# EAGLE schematic pe project (EAGLE 9.6.2)
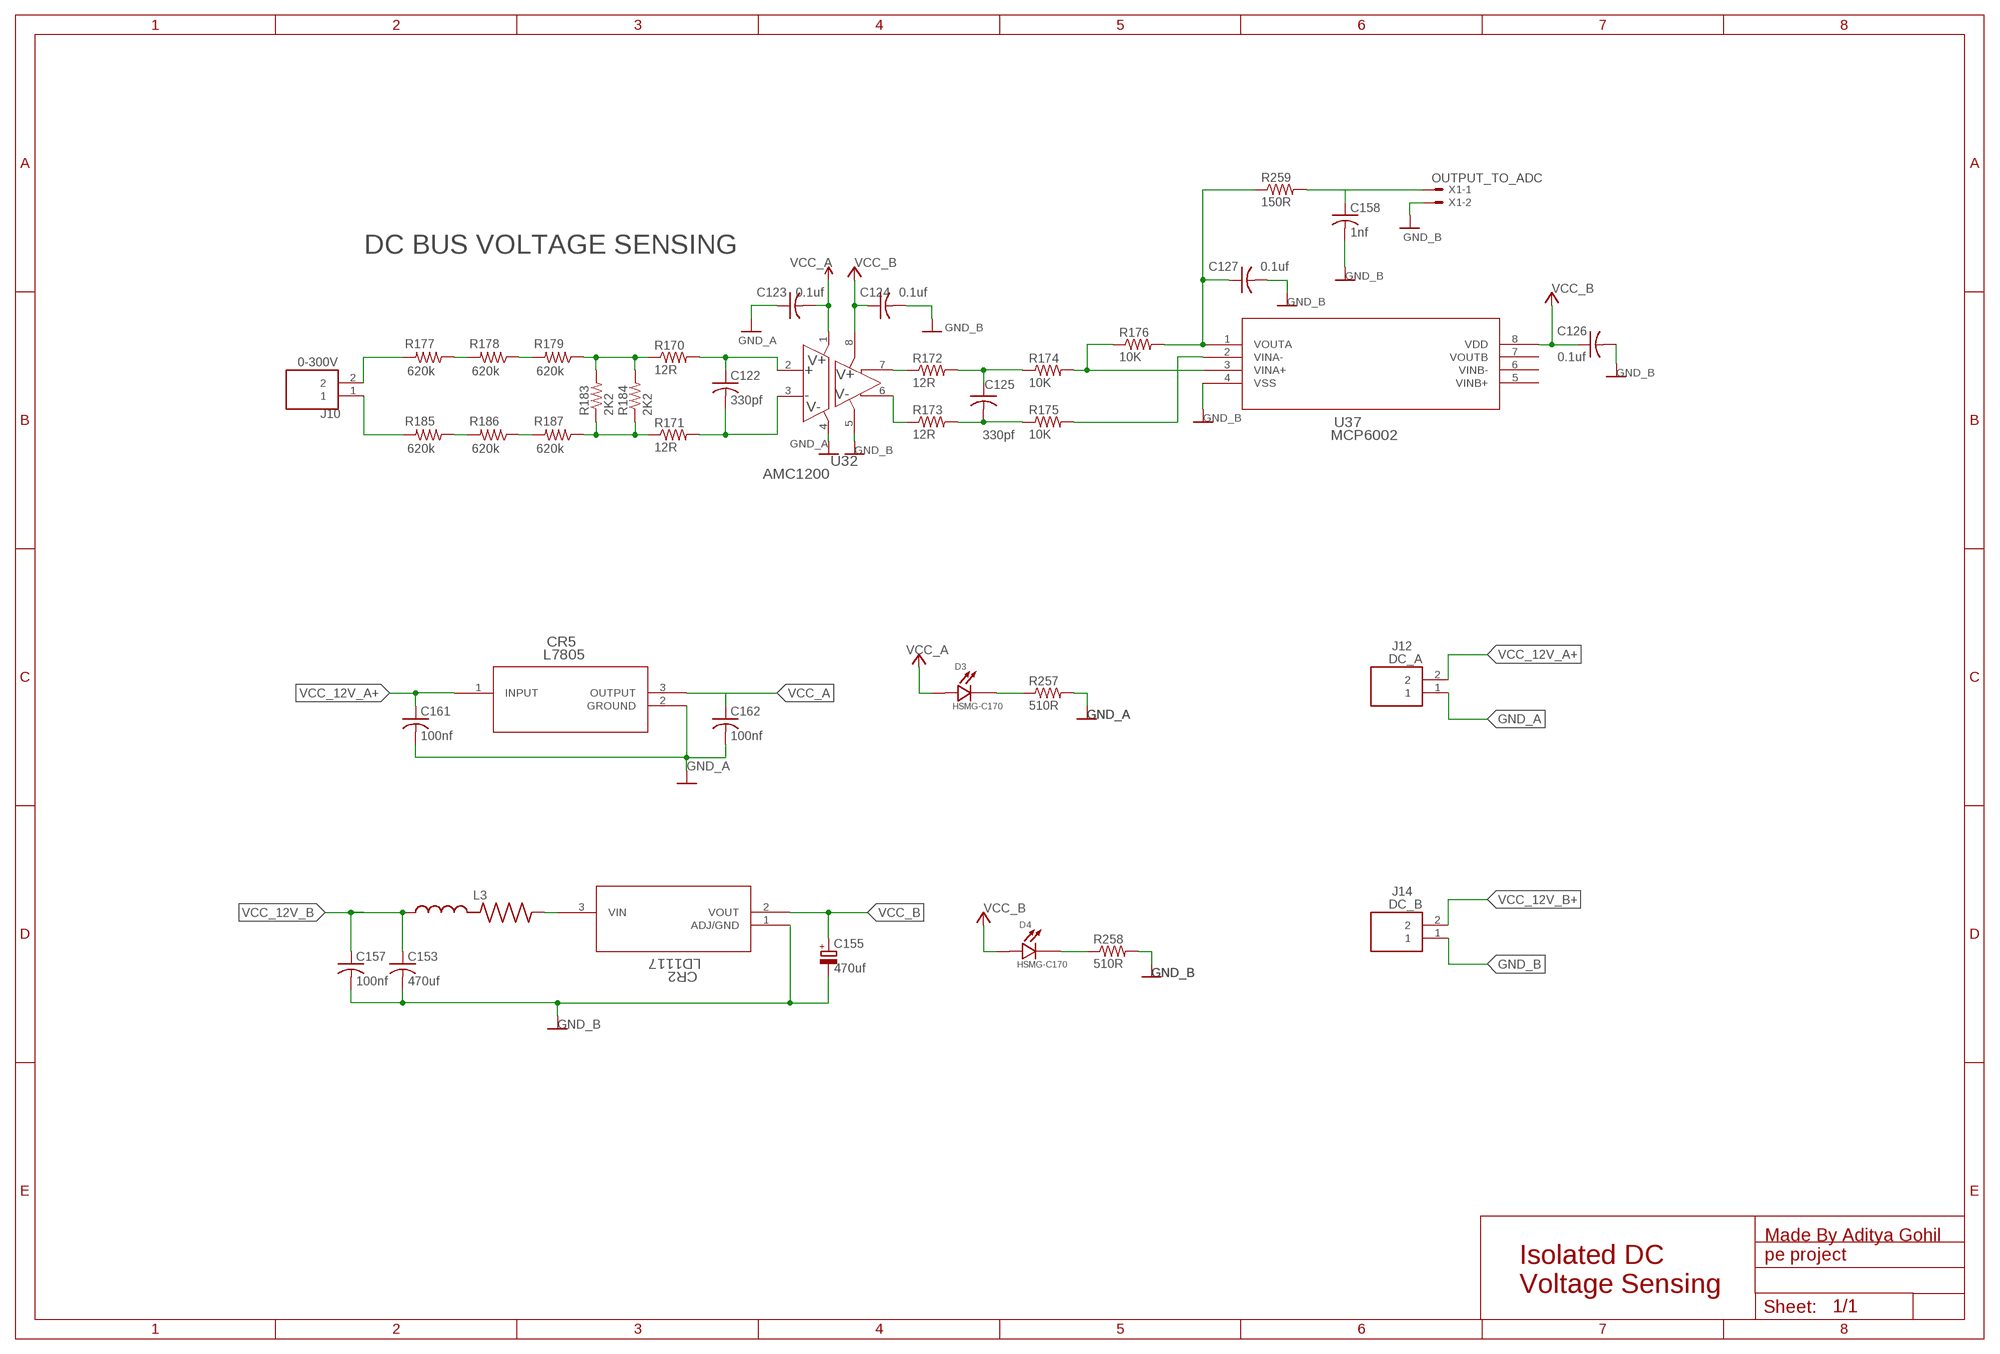
[diagram p0: schematic, sheet 1]

## Parts
C122  330pf  C-USC1206  [C1206]
C123  0.1uf  C-USC1206  [C1206]
C124  0.1uf  C-USC1206  [C1206]
C125  330pf  C-USC1206  [C1206]
C126  0.1uf  C-USC1206  [C1206]
C127  0.1uf  C-USC1206  [C1206]
C153  470uf  C-USC1206  [C1206]
C155  470uf  CPOL-EUE3.5-8  [E3,5-8]
C157  100nf  C-USC1206  [C1206]
C158  1nf  C-USC1206  [C1206]
C161  100nf  C-USC1206  [C1206]
C162  100nf  C-USC1206  [C1206]
CR2  LD1117  LD1117AS33TR  [SOT-223_STM]
CR5  L7805  L7805ACV  [TO-220_STM]
D3  HSMG-C170  [LED_HSMS-C170]
D4  HSMG-C170  [LED_HSMS-C170]
J10  0-300V  4PCV-02-006  [TE_5-1437648-7]
J12  DC_A  4PCV-02-006  [TE_5-1437648-7]
J14  DC_B  4PCV-02-006  [TE_5-1437648-7]
L3  32ohm  BLE32PN300SZ1L  [BEADC3225X220N]
R170  12R  R-US_R1206  [R1206]
R171  12R  R-US_R1206  [R1206]
R172  12R  R-US_R1206  [R1206]
R173  12R  R-US_R1206  [R1206]
R174  10K  R-US_R1206  [R1206]
R175  10K  R-US_R1206  [R1206]
R176  10K  R-US_R1206  [R1206]
R177  620k  R-US_R2512  [R2512]
R178  620k  R-US_R2512  [R2512]
R179  620k  R-US_R2512  [R2512]
R183  2K2  R-US_R1206  [R1206]
R184  2K2  R-US_R1206  [R1206]
R185  620k  R-US_R2512  [R2512]
R186  620k  R-US_R2512  [R2512]
R187  620k  R-US_R2512  [R2512]
R257  510R  R-US_R1206  [R1206]
R258  510R  R-US_R1206  [R1206]
R259  150R  R-US_R1206  [R1206]
U32  AMC1200  AMC1200STDUBRQ1  [DUB0008A_N]
U37  MCP6002  MCP6002T-I/SN  [SOIC8-N_MC_MCH]
X1  OUTPUT_TO_ADC  22-23-2021  [22-23-2021]

## Nets
AC_V_B_OUT: C127.1 R176.2 R259.1 U37.1(VOUTA)
GND_A: C123.1 C161.2 C162.2 CR5.2(GROUND) J12.1 R257.2 U32.4(GND1) ; supply symbol labelled GND
GND_B: C124.2 C126.2 C127.2 C153.2 C155.- C157.2 C158.2 CR2.1(ADJ/GND) J14.1 R258.2 U32.5(GND2) U37.4(VSS) X1.2 ; supply symbol labelled GND
N$1: R170.1 R179.1 R183.2 R184.2
N$2: R171.1 R183.1 R184.1 R187.1
N$43: C122.1 R170.2 U32.2(VINP)
N$46: R172.1 U32.7(VOUTP)
N$47: R173.1 U32.6(VOUTN)
N$48: C125.2 R173.2 R175.1
N$49: C125.1 R172.2 R174.1
N$50: R174.2 R176.1 U37.3(VINA+)
N$62: R177.1 R178.2
N$69: R178.1 R179.2
N$76: R175.2 U37.2(VINA-)
N$79: R185.1 R186.2
N$80: R186.1 R187.2
N$85: J10.2 R177.2
N$87: J10.1 R185.2
N$88: C122.2 R171.2 U32.3(VINN)
N$171: CR2.3(VIN) L3.2
N$176: D3.C R257.1
N$177: D4.C R258.1
OUTPUT_TO_ADC: C158.1 R259.2 X1.1
VCC_12V_A+: C161.1 CR5.1(INPUT) J12.2
VCC_12V_B: C153.1 C157.1 L3.1
VCC_12V_B+: J14.2
VCC_A: C123.2 C162.1 CR5.3(OUTPUT) D3.A U32.1(VDD1) ; supply symbol labelled VCC_2, VCC
VCC_B: C124.1 C126.1 C155.+ CR2.2(VOUT) D4.A U32.8(VDD2) U37.8(VDD) ; supply symbol labelled VCC
Unconnected: U37.5(VINB+) U37.6(VINB-) U37.7(VOUTB)

## Notes on the sheet
- DC BUS VOLTAGE SENSING
- Made By Aditya Gohil
- Isolated DC 
  Voltage Sensing

## Library data of the parts
C122-C127 C153 C157 C158 C161 C162 = rcl:C-US: CAPACITOR, American symbol; SPICEPREFIX: C
C155 = rcl:CPOL-EU: POLARIZED CAPACITOR, European symbol; SPICEPREFIX: C
CR2 = LD1117as:LD1117AS33TR; COPYRIGHT: Copyright (C) 2026 Ultra Librarian. All rights reserved.; DATASHEET: https://www.st.com/resource/en/datasheet/ld1117a.pdf; DESCRIPTION: Low drop fixed and adjustable positive voltage regulators; MANUFACTURER_NAME: STMicroelectronics; MANUFACTURER_PART_NUMBER: LD1117AS33TR
CR5 = 7805:L7805ACV; COPYRIGHT: Copyright (C) 2026 Ultra Librarian. All rights reserved.; DATASHEET: https://www.st.com/resource/en/datasheet/l78.pdf; DESCRIPTION: Positive voltage regulator ICs; MANUFACTURER_NAME: STMicroelectronics; MANUFACTURER_PART_NUMBER: L7805ACV
D3 D4 = HSMG-C170:HSMG-C170; MANUFACTURER: Broadcom; MAXIMUM_PACKAGE_HEIGHT: 0.8mm; PARTREV: March 25, 2022; SNAPEDA_PN: HSMG-C170; STANDARD: Manufacturer Recommendations
J10 J12 J14 = 4PCV-02-006:4PCV-02-006; MANUFACTURER: TE; PARTREV: R; STANDARD: Manufacturer Recommendations
L3 = BLE32PN300SZ1L:BLE32PN300SZ1L: Check availability <https://pricing.snapeda.com/parts/BLE32PN300SZ1L/Murata%20Electronics/view-part?ref=eda>; AVAILABILITY: In Stock; CHECK_PRICES: https://www.snapeda.com/parts/BLE32PN300SZ1L/Murata/view-part/?ref=eda; DESCRIPTION: 30 Ohms @ 100 MHz 1 Power Line Ferrite Bead 1210 (3225 Metric) 10A 1.6mOhm; MF: Murata Electronics; MP: BLE32PN300SZ1L; PACKAGE: 3225 Murata; PRICE: None; SNAPEDA_LINK: https://www.snapeda.com/parts/BLE32PN300SZ1L/Murata/view-part/?ref=snap
R170-R179 R183-R187 R257-R259 = rcl:R-US_: RESISTOR, American symbol; SPICEPREFIX: R
U32 = amc1200:AMC1200STDUBRQ1; COPYRIGHT: Copyright (C) 2026 Ultra Librarian. All rights reserved.; DATASHEET: https://www.ti.com/lit/gpn/amc1200-q1; DESCRIPTION: Automotive, &plusmn;250-mV input, precision current sensing basic isolated amplifier 8-SOP -40 to 105; MANUFACTURER_NAME: Texas Instruments; MANUFACTURER_PART_NUMBER: AMC1200STDUBRQ1; REFDES: RefDes; TYPE: TYPE
U37 = mcp6002:MCP6002T-I/SN; COPYRIGHT: Copyright (C) 2026 Ultra Librarian. All rights reserved.; MANUFACTURER_NAME: Microchip; MANUFACTURER_PART_NUMBER: MCP6002T-I/SN
X1 = con-molex:22-23-2021: .100" (2.54mm) Center Header - 2 Pin; MF: MOLEX; MPN: 22-23-2021; OC_FARNELL: 1462926; OC_NEWARK: 25C3832